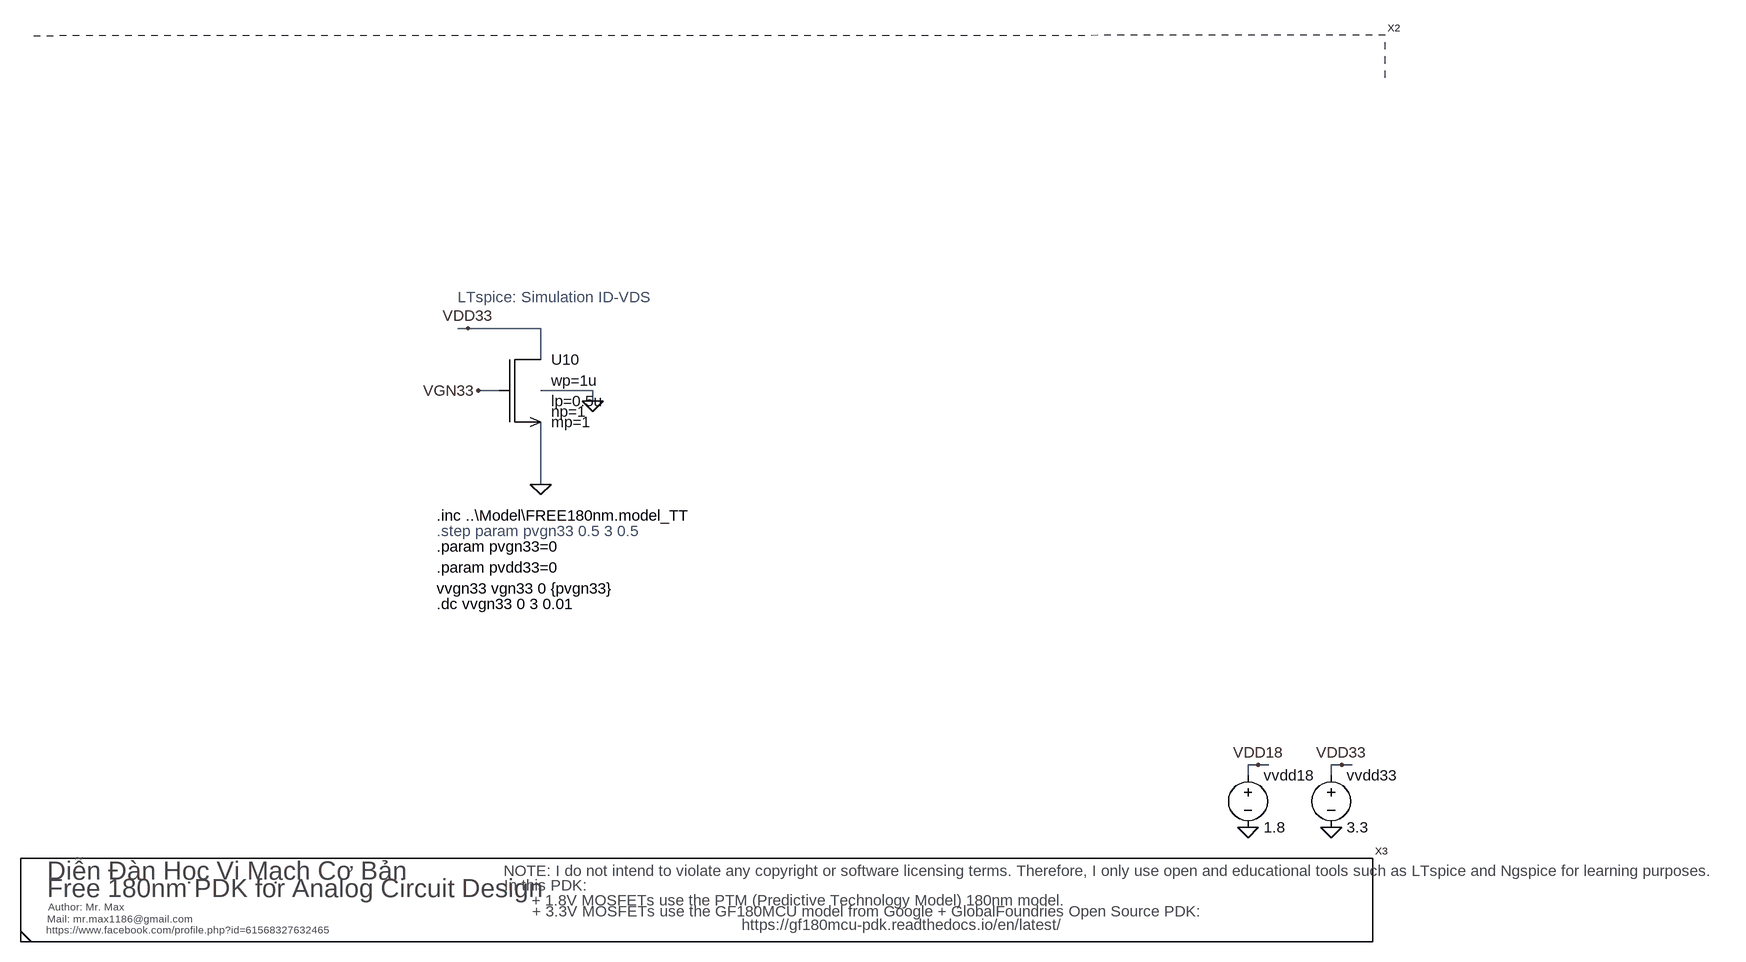
[diagram p0: schematic 04_Dev_idvgs.asc]
04_Dev_idvgs.asc, the LTspice schematic file:
Version 4
SHEET 1 3292 980
WIRE 272 -560 256 -560
WIRE 384 -560 272 -560
WIRE 384 -512 384 -560
WIRE 320 -464 288 -464
WIRE 464 -464 384 -464
WIRE 464 -448 464 -464
WIRE 384 -320 384 -416
WIRE 1488 112 1472 112
WIRE 1504 112 1488 112
WIRE 1616 112 1600 112
WIRE 1632 112 1616 112
WIRE 1472 128 1472 112
WIRE 1600 128 1600 112
FLAG 1472 208 0
FLAG 1600 208 0
FLAG 1616 112 VDD33
FLAG 1488 112 VDD18
FLAG 464 -448 0
FLAG 384 -320 0
FLAG 288 -464 VGN33
FLAG 272 -560 VDD33
SYMBOL voltage 1472 112 R0
WINDOW 123 0 0 Left 2
WINDOW 39 0 0 Left 2
SYMATTR InstName vvdd18
SYMATTR Value 1.8
SYMBOL voltage 1600 112 R0
WINDOW 123 0 0 Left 2
WINDOW 39 0 0 Left 2
SYMATTR InstName vvdd33
SYMATTR Value 3.3
SYMBOL gfmcu_nmos3p3 320 -464 R0
SYMATTR InstName U10
SYMATTR Value wp=1u
SYMATTR Value2 lp=0.5u
SYMBOL BD_GTitleLTS -416 384 R0
SYMATTR InstName X3
SYMBOL header -400 -848 R0
SYMATTR InstName X2
TEXT 224 -224 Left 2 !.param pvgn33=0
TEXT 224 -248 Left 2 ;.step param pvgn33 0.5 3 0.5
TEXT 224 -136 Left 2 !.dc vvgn33 0 3 0.01
TEXT 256 -608 Left 2 ;LTspice: Simulation ID-VDS
TEXT 224 -272 Left 2 !.inc ..\\Model\\FREE180nm.model_TT
TEXT 224 -192 Left 2 !.param pvdd33=0
TEXT 224 -160 Left 2 !vvgn33 vgn33 0 {pvgn33}

The netlist it stands for:
* 04_Dev_idvgs.asc
vvdd18 VDD18 0 1.8
vvdd33 VDD33 0 3.3
XU10 VDD33 VGN33 0 0 gfmcu_nmos3p3 wp=1u lp=0.5u np=1 mp=1  ; pins ND NG NS NB
XX3 BD_GTitleLTS
XX2 header
.param pvgn33=0
* .step param pvgn33 0.5 3 0.5
.dc vvgn33 0 3 0.01
* LTspice: Simulation ID-VDS
.inc ..\Model\FREE180nm.model_TT
.param pvdd33=0
vvgn33 vgn33 0 {pvgn33}
.lib FREE180nm.model
.backanno
.end

* Results of the author's LTspice run, read from the files saved beside the schematic
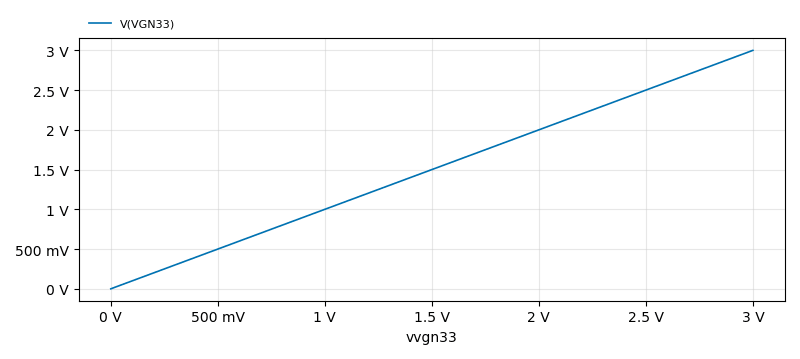
[diagram p1: DC transfer characteristic of 04_Dev_idvgs.asc, plotted from the saved traces]
* DC transfer characteristic, 1 run:
*   V(VGN33): 0 V at vvgn33=0 V, 3 V at vvgn33=3 V, min 0 V, max 3 V